# Altium schematic sheet CAN.SchDoc
size A4
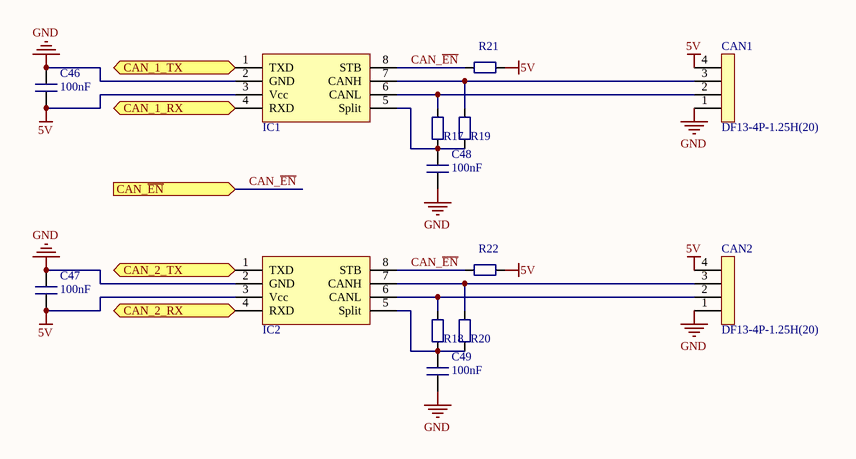
[diagram p0: CAN.SchDoc]

## Parts
C46  100nF  [C0603H08_M]
C47  100nF  [C0603H08_M]
C48  100nF  [C0603H08_M]
C49  100nF  [C0603H08_M]
CAN1  DF13-4P-1.25H(20)  [DF13-4P-1.25H(20)]
CAN2  DF13-4P-1.25H(20)  [DF13-4P-1.25H(20)]
IC1  CAN Transceiver SN65HVD1040A  [SOIC127P600X175-8N]  (value not drawn)
IC2  CAN Transceiver SN65HVD1040A  [SOIC127P600X175-8N]  (value not drawn)
R17  .Resistor  [R0603H05_M]  (value not drawn)
R18  .Resistor  [R0603H05_M]  (value not drawn)
R19  .Resistor  [R0603H05_M]  (value not drawn)
R20  .Resistor  [R0603H05_M]  (value not drawn)
R21  .Resistor  [R0603H05_M]  (value not drawn)
R22  .Resistor  [R0603H05_M]  (value not drawn)

## Ports
CAN_1_RX (out), CAN_1_TX (in), CAN_2_RX (out), CAN_2_TX (in), CAN_~{EN} (in)

## Nets
5V: C46.2 C47.2 CAN1.4 CAN2.4 IC1.3(Vcc) IC2.3(Vcc) R21.2 R22.2
GND: C46.1 C47.1 C48.2 C49.2 CAN1.1 CAN2.1 IC1.2(GND) IC2.2(GND)
CAN_1_RX: IC1.4(RXD) ; port CAN_1_RX
CAN_1_TX: IC1.1(TXD) ; port CAN_1_TX
CAN_2_RX: IC2.4(RXD) ; port CAN_2_RX
CAN_2_TX: IC2.1(TXD) ; port CAN_2_TX
CAN_~{EN}: IC1.8(STB) IC2.8(STB) R21.1 R22.1 ; port CAN_~{EN}
NetC48_1: C48.1 IC1.5(Split) R17.2 R19.2
NetC49_1: C49.1 IC2.5(Split) R18.2 R20.2
NetCAN1_2: CAN1.2 IC1.6(CANL) R17.1
NetCAN1_3: CAN1.3 IC1.7(CANH) R19.1
NetCAN2_2: CAN2.2 IC2.6(CANL) R18.1
NetCAN2_3: CAN2.3 IC2.7(CANH) R20.1

## Library data of the parts
C46-C49 = C 100nF 100V 0603 MLCC X7R: Form: 0603 [M 1608]; Temperature Coeffizient: 0ppm/°C +- 30ppm/°C; Tolerance: +-10%; Price: 0.044; Series: X7R; Voltage Rating: 100V; Temperature Range: -55°C to +125°C; Value: 100nF
CAN1 CAN2 = Hirose DF13-4P-1.25H(20): Circuits: 4; Connector Orientation: Right Angle; Model: DF13-4P-1.25H(20); Mounting Style: SMT
IC1 IC2 = CAN Transceiver SN65HVD1040A: EMC-OPTIMIZED HIGH SPEED CAN TRANSCEIVER; Farnell Order Number: 2335646; Price: 1.41; Farnell: http://de.farnell.com/texas-instruments/sn65hvd1040aqdrq1/can-transceiver-1mbps-1dr-1rx-soic/dp/2335646